# Altium schematic sheet PDB_Mother_v1.1_Sheet.SchDoc: PDB1.0_Mother
size A1; SheetNumber: 1; SheetTotal: 1
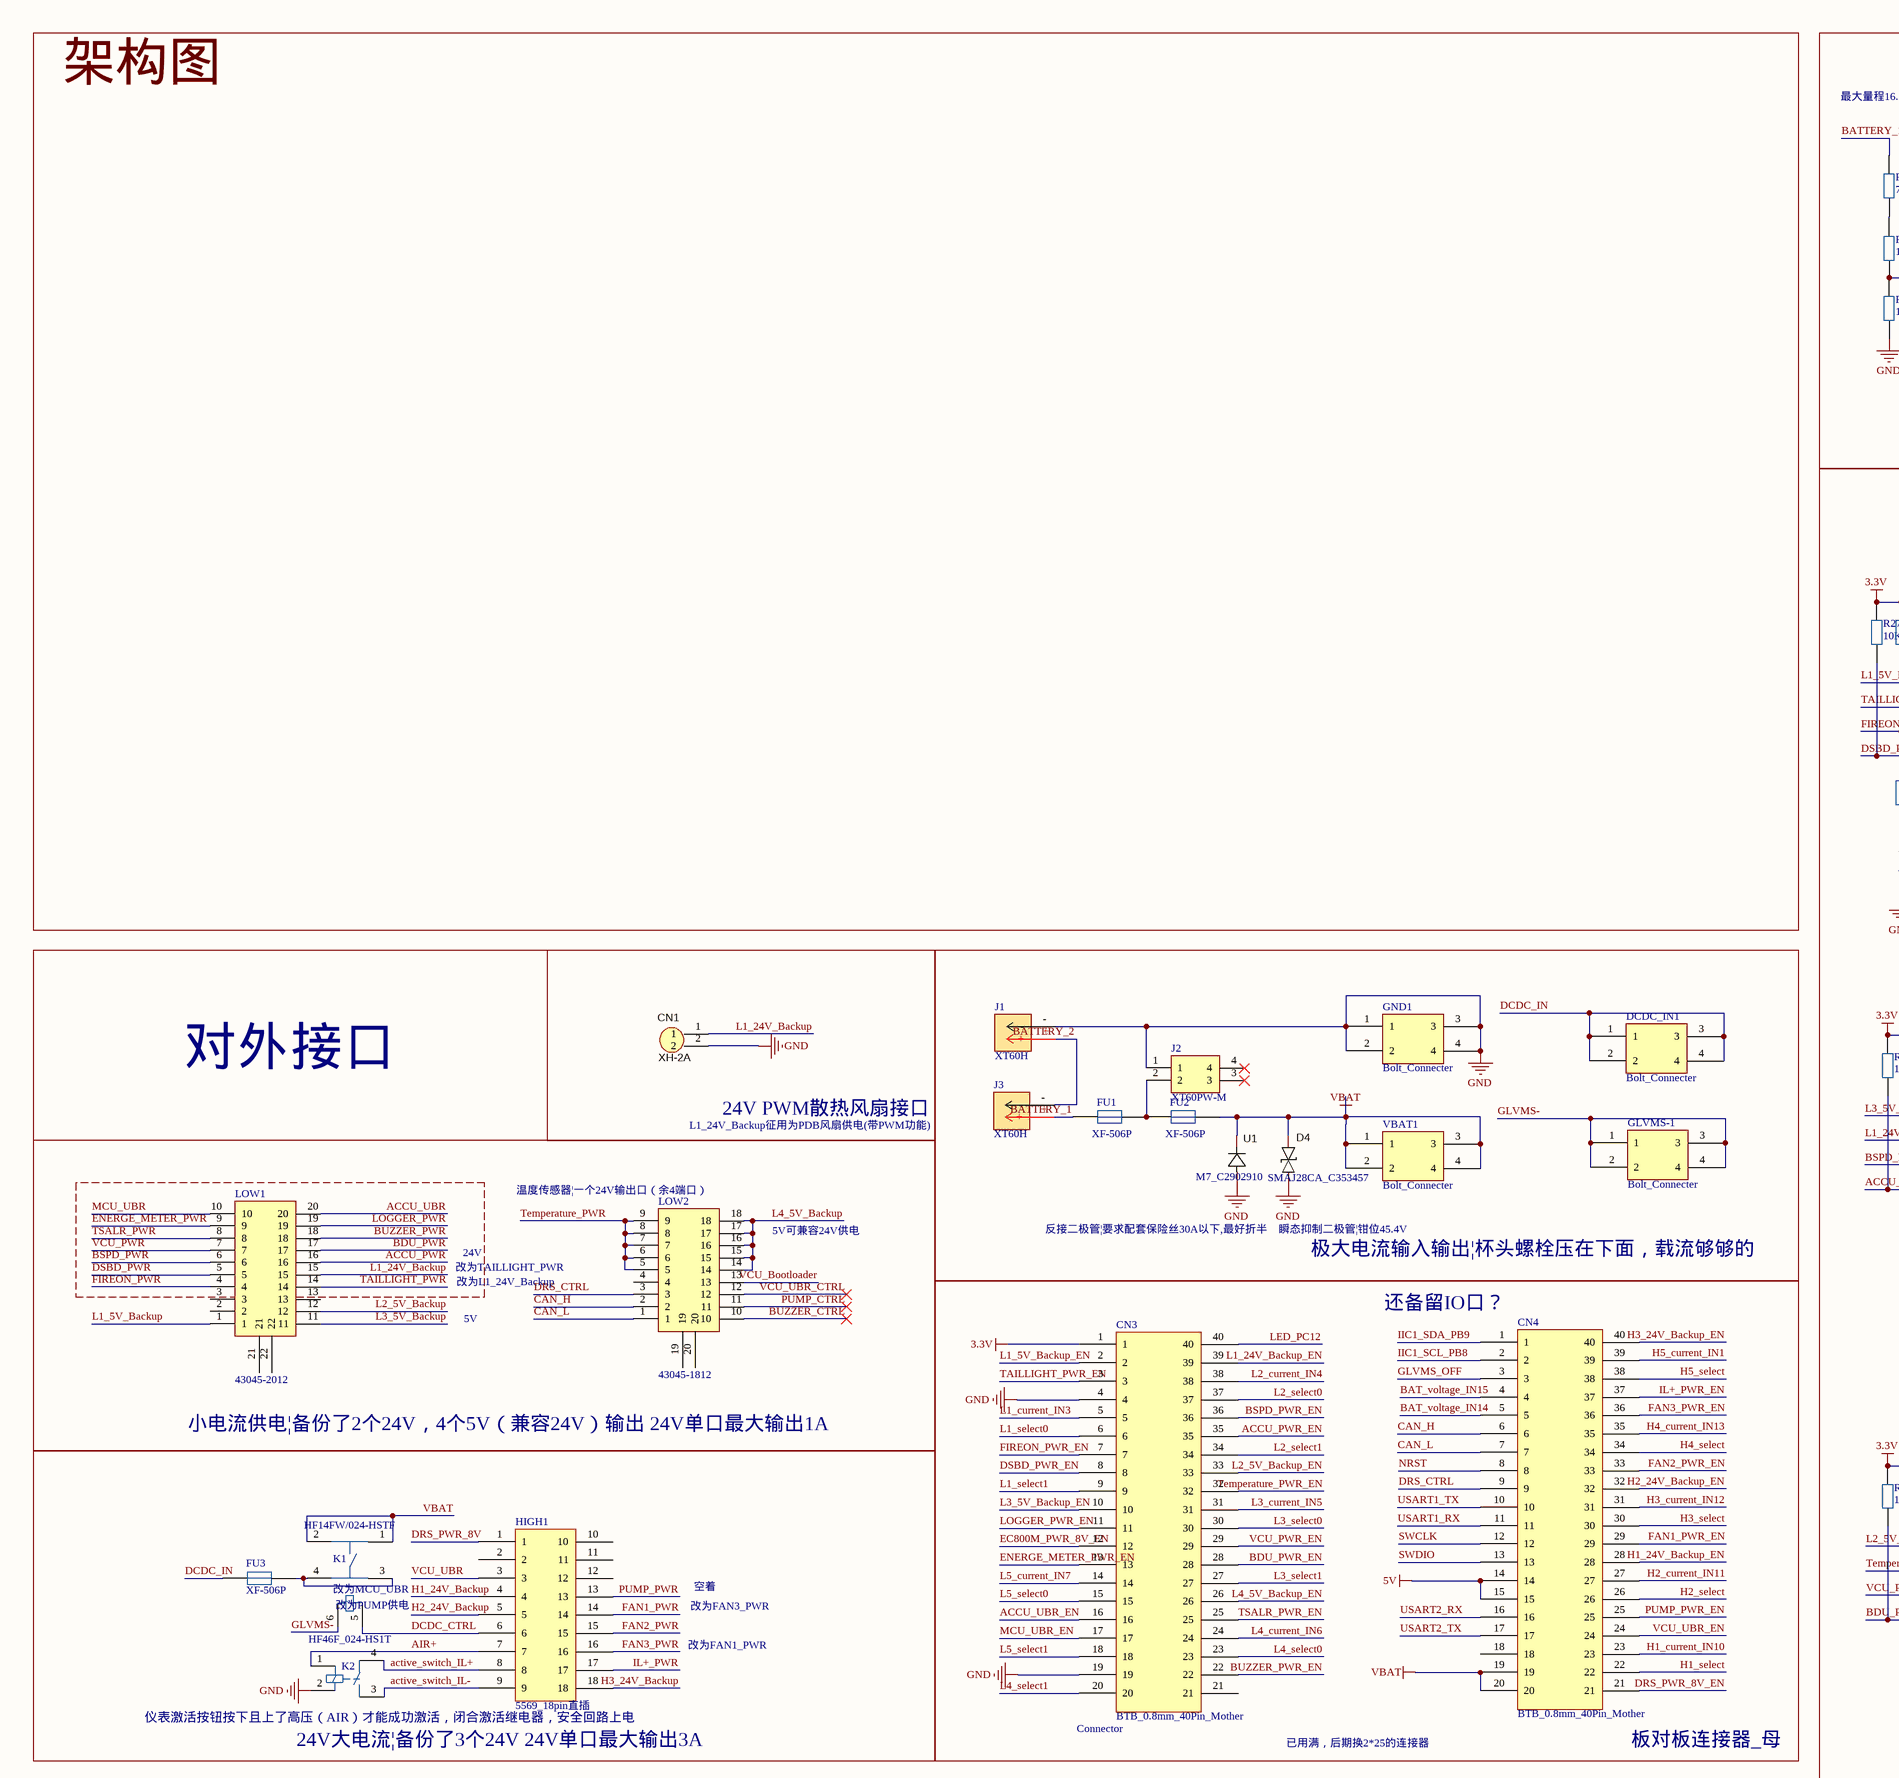
[diagram p0: PDB_Mother_v1.1_Sheet.SchDoc, top left]
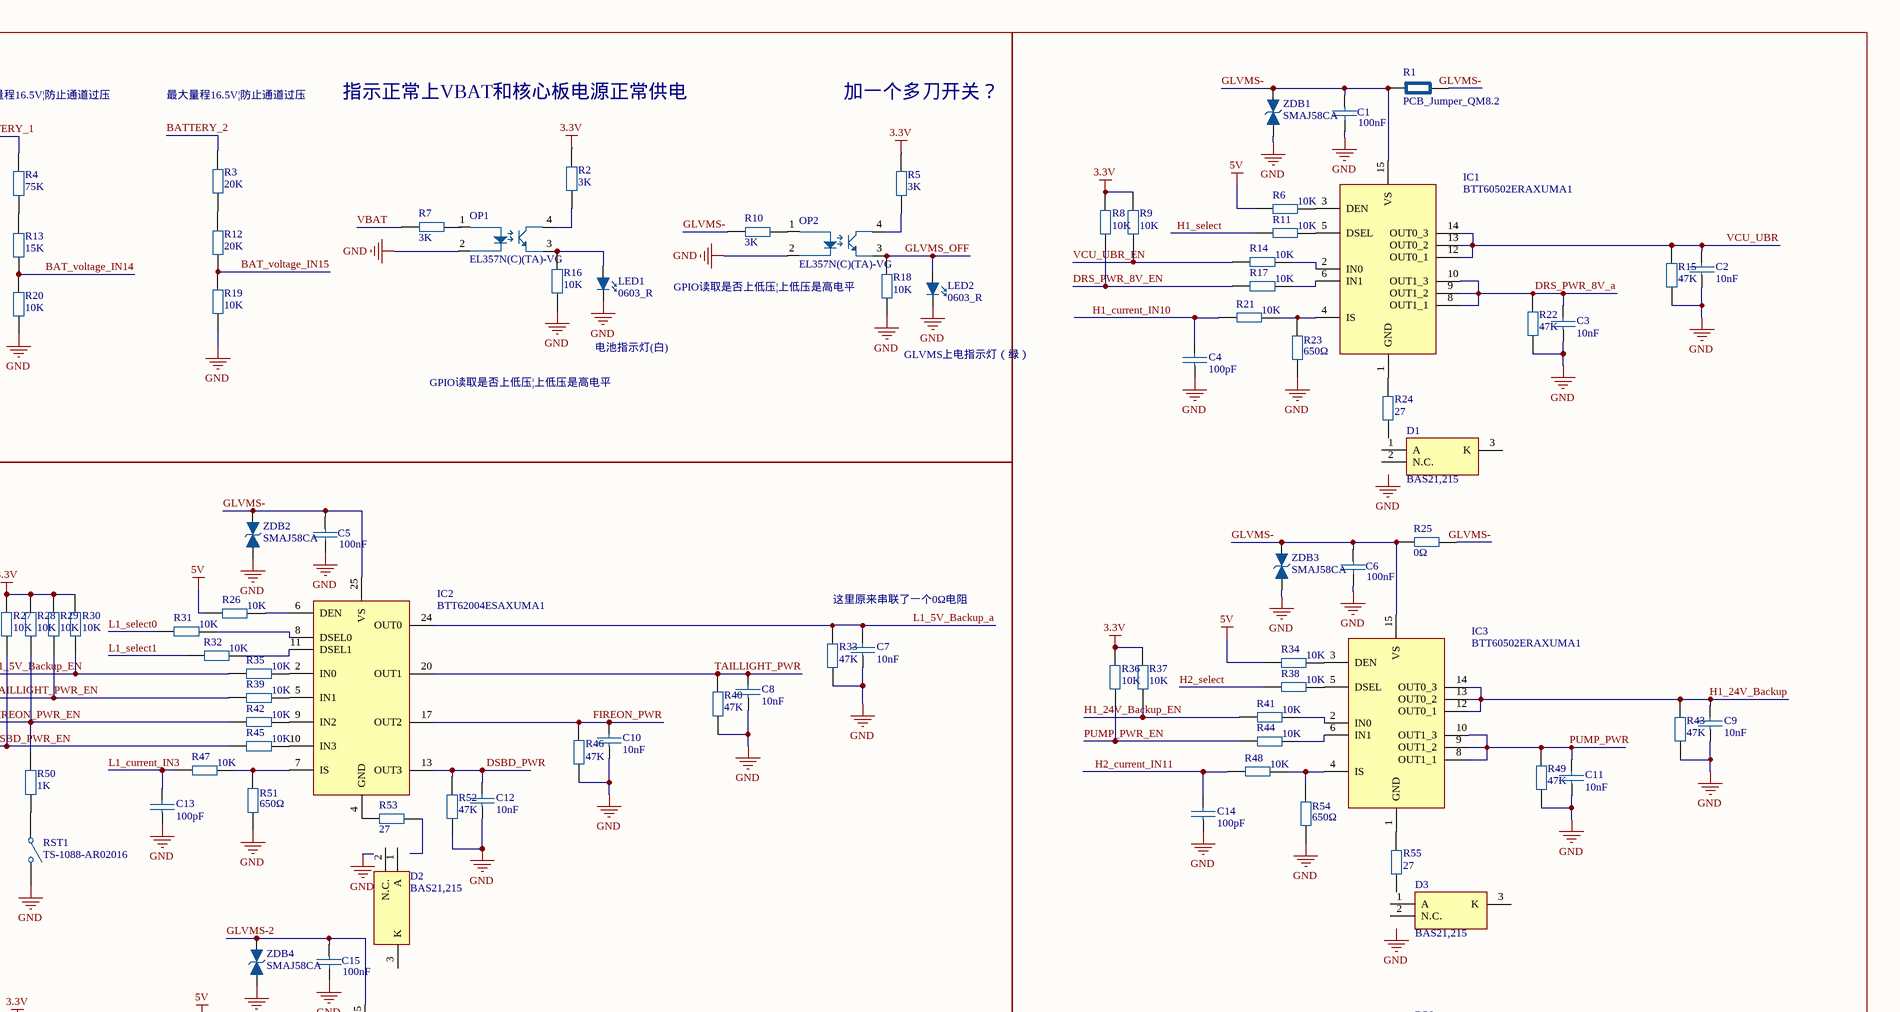
[diagram p1: PDB_Mother_v1.1_Sheet.SchDoc, top right]
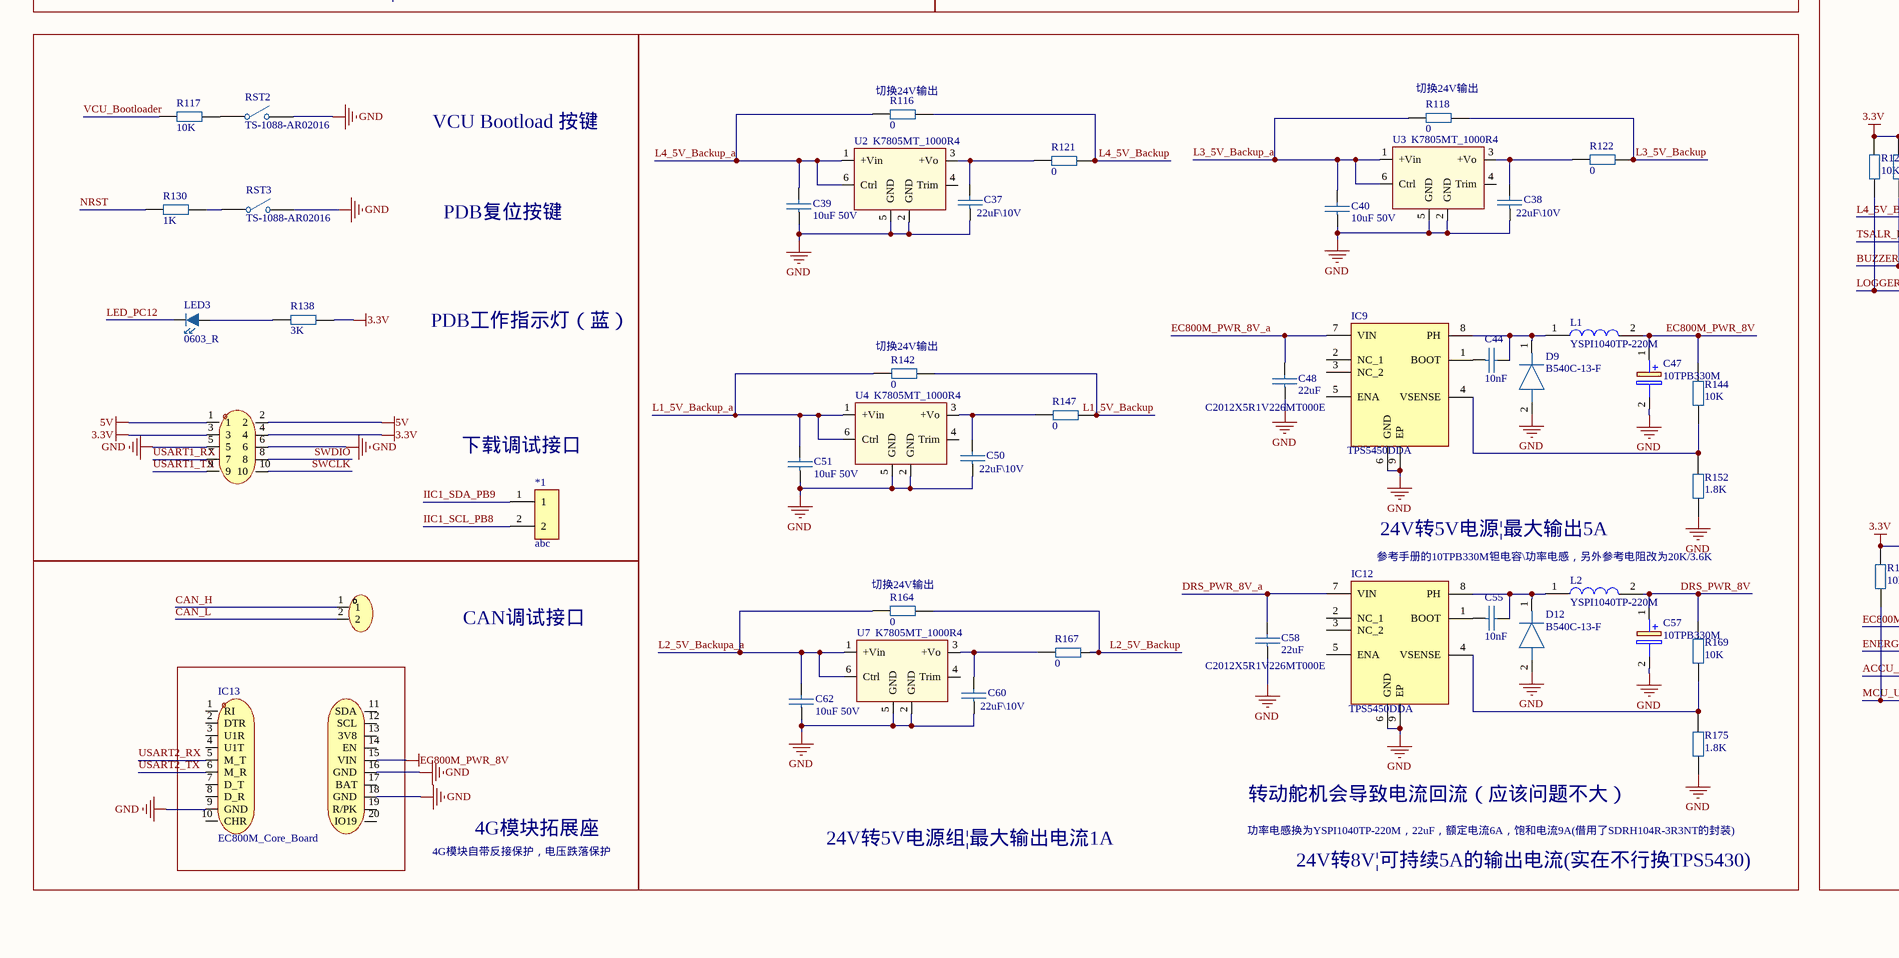
[diagram p2: PDB_Mother_v1.1_Sheet.SchDoc, bottom left]
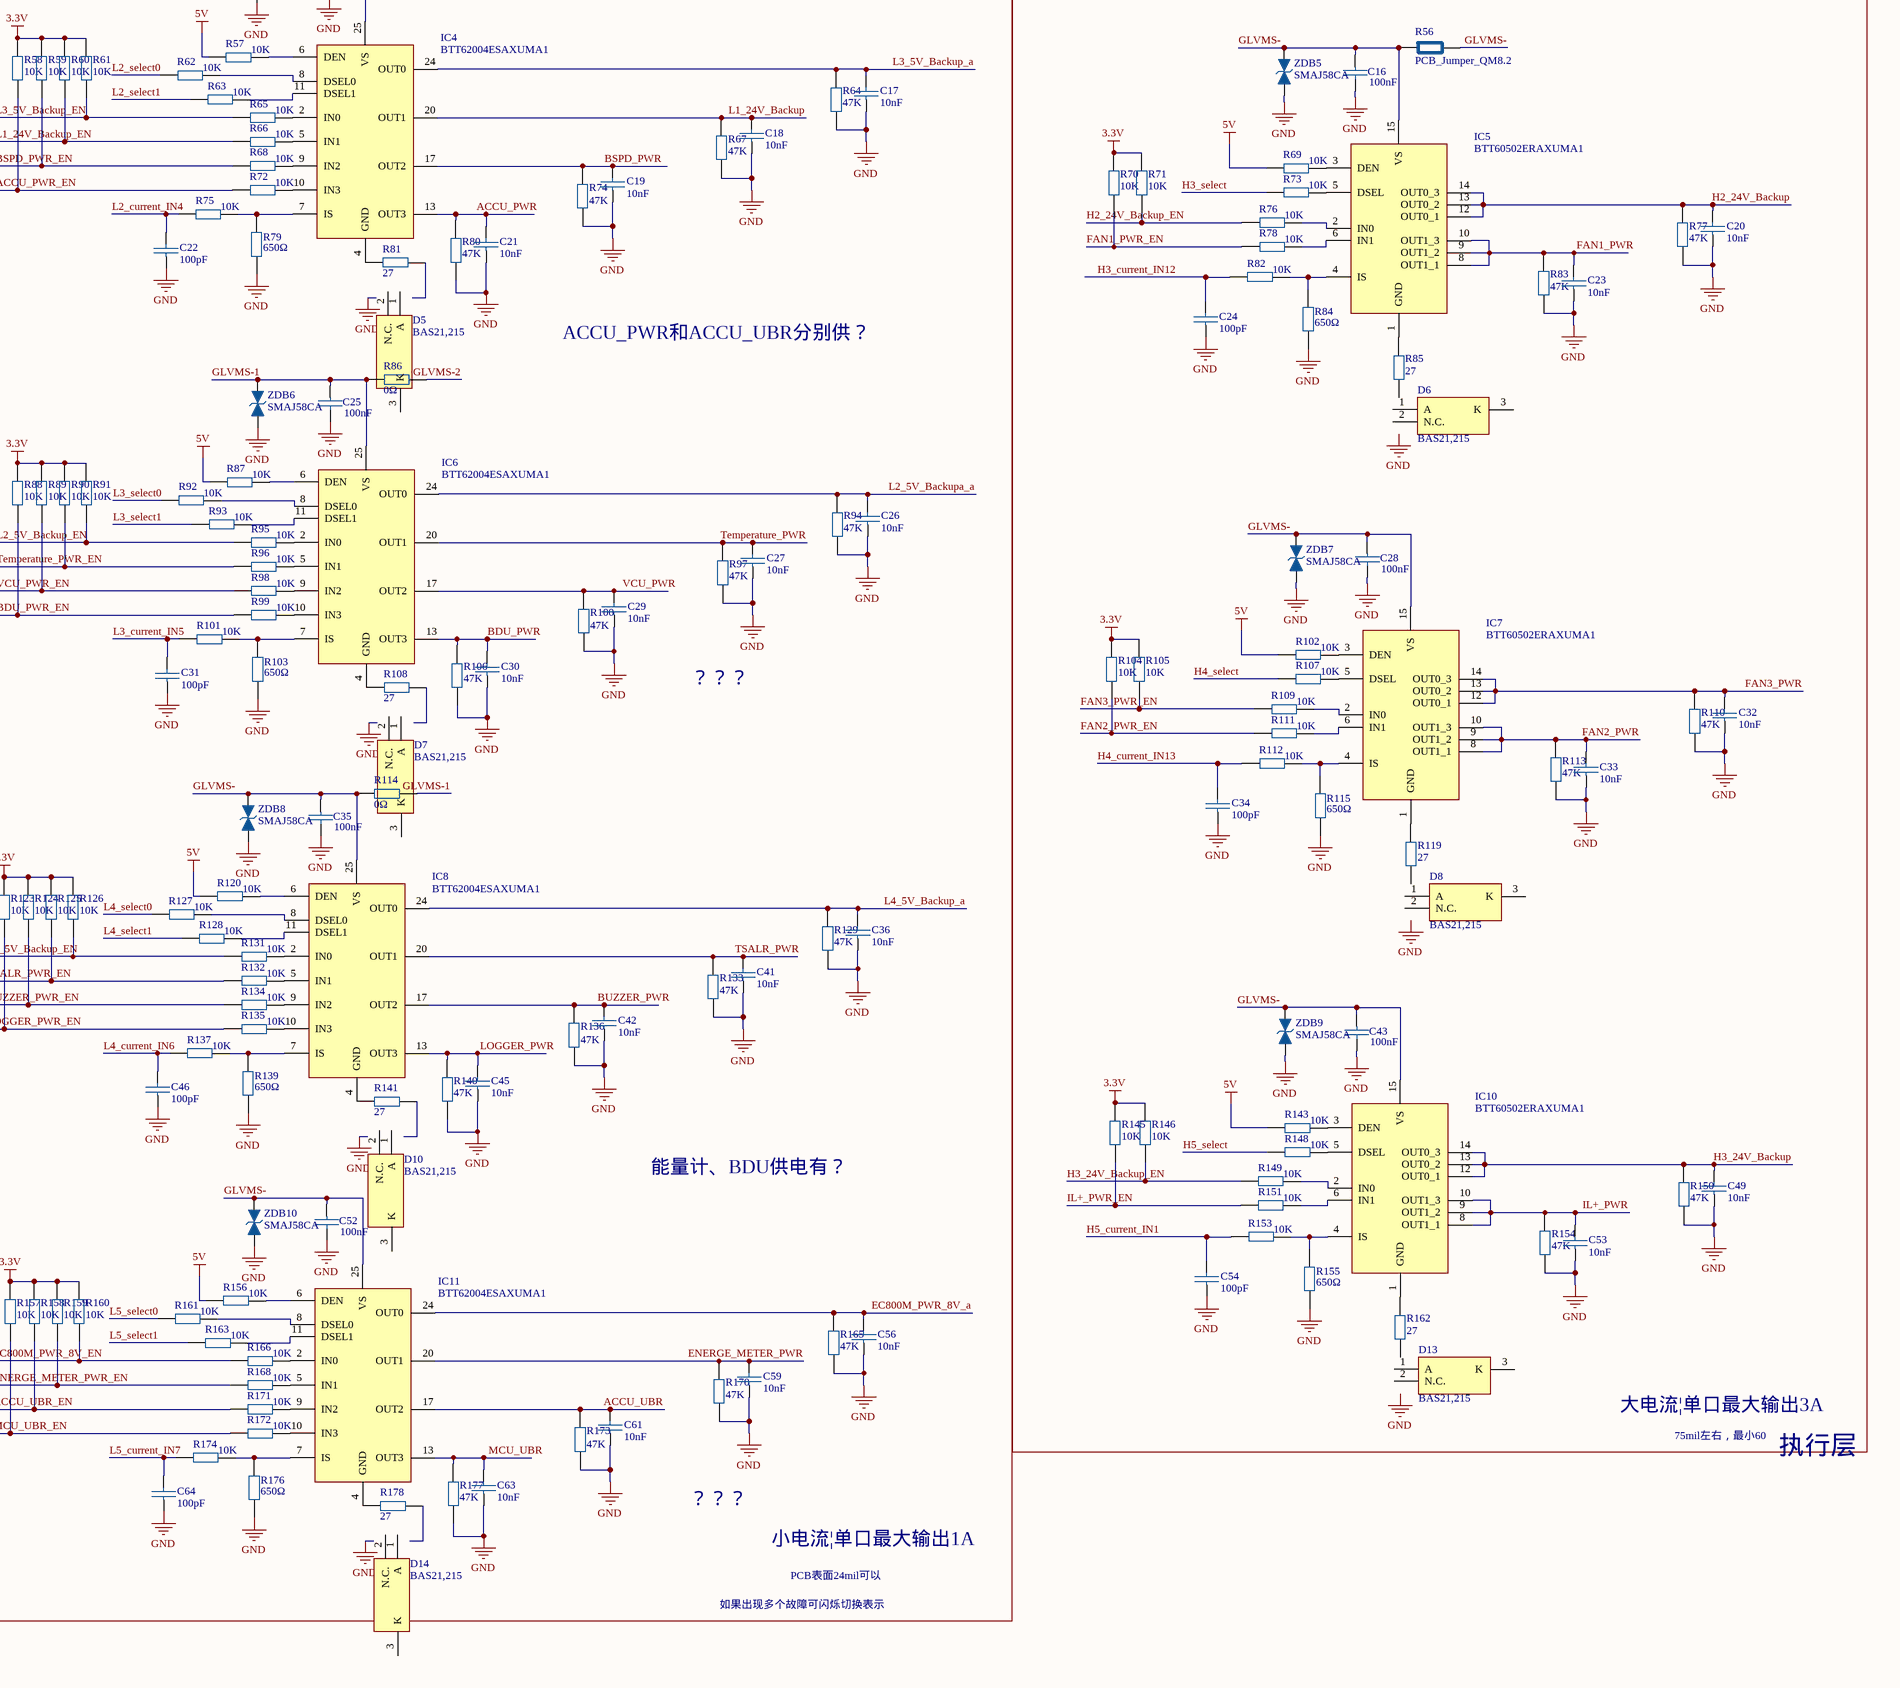
[diagram p3: PDB_Mother_v1.1_Sheet.SchDoc, bottom right]

## Parts
*1  abc  [abc]
C1  100nF  [CAPC1608X08N__0603CAPUNPOLE]
C2  10nF  [CAPC1608X08N__0603CAPUNPOLE]
C3  10nF  [CAPC1608X08N__0603CAPUNPOLE]
C4  100pF  [CAPC1608X08N__0603CAPUNPOLE]
C5  100nF  [CAPC1608X08N__0603CAPUNPOLE]
C6  100nF  [CAPC1608X08N__0603CAPUNPOLE]
C7  10nF  [CAPC1608X08N__0603CAPUNPOLE]
C8  10nF  [CAPC1608X08N__0603CAPUNPOLE]
C9  10nF  [CAPC1608X08N__0603CAPUNPOLE]
C10  10nF  [CAPC1608X08N__0603CAPUNPOLE]
C11  10nF  [CAPC1608X08N__0603CAPUNPOLE]
C12  10nF  [CAPC1608X08N__0603CAPUNPOLE]
C13  100pF  [CAPC1608X08N__0603CAPUNPOLE]
C14  100pF  [CAPC1608X08N__0603CAPUNPOLE]
C15  100nF  [CAPC1608X08N__0603CAPUNPOLE]
C16  100nF  [CAPC1608X08N__0603CAPUNPOLE]
C17  10nF  [CAPC1608X08N__0603CAPUNPOLE]
C18  10nF  [CAPC1608X08N__0603CAPUNPOLE]
C19  10nF  [CAPC1608X08N__0603CAPUNPOLE]
C20  10nF  [CAPC1608X08N__0603CAPUNPOLE]
C21  10nF  [CAPC1608X08N__0603CAPUNPOLE]
C22  100pF  [CAPC1608X08N__0603CAPUNPOLE]
C23  10nF  [CAPC1608X08N__0603CAPUNPOLE]
C24  100pF  [CAPC1608X08N__0603CAPUNPOLE]
C25  100nF  [CAPC1608X08N__0603CAPUNPOLE]
C26  10nF  [CAPC1608X08N__0603CAPUNPOLE]
C27  10nF  [CAPC1608X08N__0603CAPUNPOLE]
C28  100nF  [CAPC1608X08N__0603CAPUNPOLE]
C29  10nF  [CAPC1608X08N__0603CAPUNPOLE]
C30  10nF  [CAPC1608X08N__0603CAPUNPOLE]
C31  100pF  [CAPC1608X08N__0603CAPUNPOLE]
C32  10nF  [CAPC1608X08N__0603CAPUNPOLE]
C33  10nF  [CAPC1608X08N__0603CAPUNPOLE]
C34  100pF  [CAPC1608X08N__0603CAPUNPOLE]
C35  100nF  [CAPC1608X08N__0603CAPUNPOLE]
C36  10nF  [CAPC1608X08N__0603CAPUNPOLE]
C37  22uF\10V  [CAPC1608X08N__0603CAPUNPOLE]
C38  22uF\10V  [CAPC1608X08N__0603CAPUNPOLE]
C39  10uF 50V  [CAPC3216X16N_1206CAPUNPOLE]
C40  10uF 50V  [CAPC3216X16N_1206CAPUNPOLE]
C41  10nF  [CAPC1608X08N__0603CAPUNPOLE]
C42  10nF  [CAPC1608X08N__0603CAPUNPOLE]
C43  100nF  [CAPC1608X08N__0603CAPUNPOLE]
C44  10nF  [CAPC1608X08N__0603CAPUNPOLE]
C45  10nF  [CAPC1608X08N__0603CAPUNPOLE]
C46  100pF  [CAPC1608X08N__0603CAPUNPOLE]
C47  10TPB330M  [POSCAP_D12_D15_D15E_D2E_D2_D3L_D4]
C48  22uF  [CAPC2012X06N__0805CAPUNPOLE]
C49  10nF  [CAPC1608X08N__0603CAPUNPOLE]
C50  22uF\10V  [CAPC1608X08N__0603CAPUNPOLE]
C51  10uF 50V  [CAPC3216X16N_1206CAPUNPOLE]
C52  100nF  [CAPC1608X08N__0603CAPUNPOLE]
C53  10nF  [CAPC1608X08N__0603CAPUNPOLE]
C54  100pF  [CAPC1608X08N__0603CAPUNPOLE]
C55  10nF  [CAPC1608X08N__0603CAPUNPOLE]
C56  10nF  [CAPC1608X08N__0603CAPUNPOLE]
C57  10TPB330M  [POSCAP_D12_D15_D15E_D2E_D2_D3L_D4]
C58  22uF  [CAPC2012X06N__0805CAPUNPOLE]
C59  10nF  [CAPC1608X08N__0603CAPUNPOLE]
C60  22uF\10V  [CAPC1608X08N__0603CAPUNPOLE]
C61  10nF  [CAPC1608X08N__0603CAPUNPOLE]
C62  10uF 50V  [CAPC3216X16N_1206CAPUNPOLE]
C63  10nF  [CAPC1608X08N__0603CAPUNPOLE]
C64  100pF  [CAPC1608X08N__0603CAPUNPOLE]
CN1  XH-2A  [CONN-TH_XH-2A]
CN3  BTB_0.8mm_40Pin_Mother  System: Connector  [BTB_0.8mm_40PIN_M]
CN4  BTB_0.8mm_40Pin_Mother  [BTB_0.8mm_40PIN_M]
D1  BAS21,215  [BAS21215]
D2  BAS21,215  [BAS21215]
D3  BAS21,215  [BAS21215]
D4  SMAJ28CA_C353457  [SMA_L4.3-W2.5-LS5.0-BI]
D5  BAS21,215  [BAS21215]
D6  BAS21,215  [BAS21215]
D7  BAS21,215  [BAS21215]
D8  BAS21,215  [BAS21215]
D9  B540C-13-F  [DIOM7959X250N]
D10  BAS21,215  [BAS21215]
D12  B540C-13-F  [DIOM7959X250N]
D13  BAS21,215  [BAS21215]
D14  BAS21,215  [BAS21215]
DCDC_IN1  Bolt_Connecter  [Bolt_Connecter]
FU1  XF-506P  [XF-506P]
FU2  XF-506P  [XF-506P]
FU3  XF-506P  [XF-506P]
GLVMS-1  Bolt_Connecter  [Bolt_Connecter]
GND1  Bolt_Connecter  [Bolt_Connecter]
HIGH1  5569_18pin直插  [5569_18Pin]
IC1  BTT60502ERAXUMA1  [PG-TDSO-14]
IC2  BTT62004ESAXUMA1  [PG-TSDSO-24]
IC3  BTT60502ERAXUMA1  [PG-TDSO-14]
IC4  BTT62004ESAXUMA1  [PG-TSDSO-24]
IC5  BTT60502ERAXUMA1  [PG-TDSO-14]
IC6  BTT62004ESAXUMA1  [PG-TSDSO-24]
IC7  BTT60502ERAXUMA1  [PG-TDSO-14]
IC8  BTT62004ESAXUMA1  [PG-TSDSO-24]
IC9  TPS5450DDA  [SOIC127P600X170-9N]
IC10  BTT60502ERAXUMA1  [PG-TDSO-14]
IC11  BTT62004ESAXUMA1  [PG-TSDSO-24]
IC12  TPS5450DDA  [SOIC127P600X170-9N]
IC13  EC800M_Core_Board  [EC800M_Core_Board]
J1  XT60H  [AMASS_XT60_NOMAL]
J2  XT60PW-M  [XT60PWM]
J3  XT60H  [AMASS_XT60_NOMAL]
K1  HF14FW/024-HSTF  [HF14FW005HPTF]
K2  HF46F_024-HS1T  [HF46F024HS1T]
L1  YSPI1040TP-220M  [SDRH104R3R3NT]
L2  YSPI1040TP-220M  [SDRH104R3R3NT]
LED1  0603_R  [LED0603-RD_RED]
LED2  0603_R  [LED0603-RD_RED]
LED3  0603_R  [LED0603-RD_RED]
LOW1  43045-2012  [43045-20YY_121314]
LOW2  43045-1812  [43045-18YY_121314]
OP1  EL357N(C)(TA)-VG  [SOP-4-2.54mm]
OP2  EL357N(C)(TA)-VG  [SOP-4-2.54mm]
R1  PCB_Jumper_QM8.2  [PCB_Jumper]
R2  3K  [RESC3116X06N__1206RES]
R3  20K  [RESC1608X04N_0603RES]
R4  75K  [RESC1608X04N_0603RES]
R5  3K  [RESC3116X06N__1206RES]
R6  10K  [RESC1608X04N_0603RES]
R7  3K  [RESC3116X06N__1206RES]
R8  10K  [RESC1608X04N_0603RES]
R9  10K  [RESC1608X04N_0603RES]
R10  3K  [RESC3116X06N__1206RES]
R11  10K  [RESC1608X04N_0603RES]
R12  20K  [RESC1608X04N_0603RES]
R13  15K  [RESC1608X04N_0603RES]
R14  10K  [RESC1608X04N_0603RES]
R15  47K  [RESC1608X04N_0603RES]
R16  10K  [RESC1608X04N_0603RES]
R17  10K  [RESC1608X04N_0603RES]
R18  10K  [RESC1608X04N_0603RES]
R19  10K  [RESC1608X04N_0603RES]
R20  10K  [RESC1608X04N_0603RES]
R21  10K  [RESC1608X04N_0603RES]
R22  47K  [RESC1608X04N_0603RES]
R23  650Ω  [RESC1608X04N_0603RES]
R24  27  [RESC1608X04N_0603RES]
R25  0Ω  [RESC6432X06N__2512RES]
R26  10K  [RESC1608X04N_0603RES]
R27  10K  [RESC1608X04N_0603RES]
R28  10K  [RESC1608X04N_0603RES]
R29  10K  [RESC1608X04N_0603RES]
R30  10K  [RESC1608X04N_0603RES]
R31  10K  [RESC1608X04N_0603RES]
R32  10K  [RESC1608X04N_0603RES]
R33  47K  [RESC1608X04N_0603RES]
R34  10K  [RESC1608X04N_0603RES]
R35  10K  [RESC1608X04N_0603RES]
R36  10K  [RESC1608X04N_0603RES]
R37  10K  [RESC1608X04N_0603RES]
R38  10K  [RESC1608X04N_0603RES]
R39  10K  [RESC1608X04N_0603RES]
R40  47K  [RESC1608X04N_0603RES]
R41  10K  [RESC1608X04N_0603RES]
R42  10K  [RESC1608X04N_0603RES]
R43  47K  [RESC1608X04N_0603RES]
R44  10K  [RESC1608X04N_0603RES]
R45  10K  [RESC1608X04N_0603RES]
R46  47K  [RESC1608X04N_0603RES]
R47  10K  [RESC1608X04N_0603RES]
R48  10K  [RESC1608X04N_0603RES]
R49  47K  [RESC1608X04N_0603RES]
R50  1K  [RESC1608X04N_0603RES]
R51  650Ω  [RESC1608X04N_0603RES]
R52  47K  [RESC1608X04N_0603RES]
R53  27  [RESC1608X04N_0603RES]
R54  650Ω  [RESC1608X04N_0603RES]
R55  27  [RESC1608X04N_0603RES]
R56  PCB_Jumper_QM8.2  [PCB_Jumper]
R57  10K  [RESC1608X04N_0603RES]
R58  10K  [RESC1608X04N_0603RES]
R59  10K  [RESC1608X04N_0603RES]
R60  10K  [RESC1608X04N_0603RES]
R61  10K  [RESC1608X04N_0603RES]
R62  10K  [RESC1608X04N_0603RES]
R63  10K  [RESC1608X04N_0603RES]
R64  47K  [RESC1608X04N_0603RES]
R65  10K  [RESC1608X04N_0603RES]
R66  10K  [RESC1608X04N_0603RES]
R67  47K  [RESC1608X04N_0603RES]
R68  10K  [RESC1608X04N_0603RES]
R69  10K  [RESC1608X04N_0603RES]
R70  10K  [RESC1608X04N_0603RES]
R71  10K  [RESC1608X04N_0603RES]
R72  10K  [RESC1608X04N_0603RES]
R73  10K  [RESC1608X04N_0603RES]
R74  47K  [RESC1608X04N_0603RES]
R75  10K  [RESC1608X04N_0603RES]
R76  10K  [RESC1608X04N_0603RES]
R77  47K  [RESC1608X04N_0603RES]
R78  10K  [RESC1608X04N_0603RES]
R79  650Ω  [RESC1608X04N_0603RES]
R80  47K  [RESC1608X04N_0603RES]
R81  27  [RESC1608X04N_0603RES]
R82  10K  [RESC1608X04N_0603RES]
R83  47K  [RESC1608X04N_0603RES]
R84  650Ω  [RESC1608X04N_0603RES]
R85  27  [RESC1608X04N_0603RES]
R86  0Ω  [RESC6432X06N__2512RES]
R87  10K  [RESC1608X04N_0603RES]
R88  10K  [RESC1608X04N_0603RES]
R89  10K  [RESC1608X04N_0603RES]
R90  10K  [RESC1608X04N_0603RES]
R91  10K  [RESC1608X04N_0603RES]
R92  10K  [RESC1608X04N_0603RES]
R93  10K  [RESC1608X04N_0603RES]
R94  47K  [RESC1608X04N_0603RES]
R95  10K  [RESC1608X04N_0603RES]
R96  10K  [RESC1608X04N_0603RES]
R97  47K  [RESC1608X04N_0603RES]
R98  10K  [RESC1608X04N_0603RES]
R99  10K  [RESC1608X04N_0603RES]
R100  47K  [RESC1608X04N_0603RES]
R101  10K  [RESC1608X04N_0603RES]
R102  10K  [RESC1608X04N_0603RES]
R103  650Ω  [RESC1608X04N_0603RES]
R104  10K  [RESC1608X04N_0603RES]
R105  10K  [RESC1608X04N_0603RES]
R106  47K  [RESC1608X04N_0603RES]
R107  10K  [RESC1608X04N_0603RES]
R108  27  [RESC1608X04N_0603RES]
R109  10K  [RESC1608X04N_0603RES]
R110  47K  [RESC1608X04N_0603RES]
R111  10K  [RESC1608X04N_0603RES]
R112  10K  [RESC1608X04N_0603RES]
R113  47K  [RESC1608X04N_0603RES]
R114  0Ω  [RESC6432X06N__2512RES]
R115  650Ω  [RESC1608X04N_0603RES]
R116  0  [RESC6432X06N__2512RES]
R117  10K  [RESC1608X04N_0603RES]
R118  0  [RESC6432X06N__2512RES]
R119  27  [RESC1608X04N_0603RES]
R120  10K  [RESC1608X04N_0603RES]
R121  0  [RESC6432X06N__2512RES]
R122  0  [RESC6432X06N__2512RES]
R123  10K  [RESC1608X04N_0603RES]
R124  10K  [RESC1608X04N_0603RES]
R125  10K  [RESC1608X04N_0603RES]
R126  10K  [RESC1608X04N_0603RES]
R127  10K  [RESC1608X04N_0603RES]
R128  10K  [RESC1608X04N_0603RES]
R129  47K  [RESC1608X04N_0603RES]
R130  1K  [RESC1608X04N_0603RES]
R131  10K  [RESC1608X04N_0603RES]
R132  10K  [RESC1608X04N_0603RES]
R133  47K  [RESC1608X04N_0603RES]
R134  10K  [RESC1608X04N_0603RES]
R135  10K  [RESC1608X04N_0603RES]
R136  47K  [RESC1608X04N_0603RES]
R137  10K  [RESC1608X04N_0603RES]
R138  3K  [RESC1608X04N_0603RES]
R139  650Ω  [RESC1608X04N_0603RES]
R140  47K  [RESC1608X04N_0603RES]
R141  27  [RESC1608X04N_0603RES]
R142  0  [RESC6432X06N__2512RES]
R143  10K  [RESC1608X04N_0603RES]
R144  10K  [RESC1608X04N_0603RES]
R145  10K  [RESC1608X04N_0603RES]
R146  10K  [RESC1608X04N_0603RES]
R147  0  [RESC6432X06N__2512RES]
R148  10K  [RESC1608X04N_0603RES]
R149  10K  [RESC1608X04N_0603RES]
R150  47K  [RESC1608X04N_0603RES]
R151  10K  [RESC1608X04N_0603RES]
R152  1.8K  [RESC1608X04N_0603RES]
R153  10K  [RESC1608X04N_0603RES]
R154  47K  [RESC1608X04N_0603RES]
R155  650Ω  [RESC1608X04N_0603RES]
R156  10K  [RESC1608X04N_0603RES]
R157  10K  [RESC1608X04N_0603RES]
R158  10K  [RESC1608X04N_0603RES]
R159  10K  [RESC1608X04N_0603RES]
R160  10K  [RESC1608X04N_0603RES]
R161  10K  [RESC1608X04N_0603RES]
R162  27  [RESC1608X04N_0603RES]
R163  10K  [RESC1608X04N_0603RES]
R164  0  [RESC6432X06N__2512RES]
R165  47K  [RESC1608X04N_0603RES]
R166  10K  [RESC1608X04N_0603RES]
R167  0  [RESC6432X06N__2512RES]
R168  10K  [RESC1608X04N_0603RES]
R169  10K  [RESC1608X04N_0603RES]
R170  47K  [RESC1608X04N_0603RES]
R171  10K  [RESC1608X04N_0603RES]
R172  10K  [RESC1608X04N_0603RES]
R173  47K  [RESC1608X04N_0603RES]
R174  10K  [RESC1608X04N_0603RES]
R175  1.8K  [RESC1608X04N_0603RES]
R176  650Ω  [RESC1608X04N_0603RES]
R177  47K  [RESC1608X04N_0603RES]
R178  27  [RESC1608X04N_0603RES]
RST1  TS-1088-AR02016  [SW-SMD_L3.9-W3.0-P4.45]
RST2  TS-1088-AR02016  [SW-SMD_L3.9-W3.0-P4.45]
RST3  TS-1088-AR02016  [SW-SMD_L3.9-W3.0-P4.45]
U1  M7_C2902910  [SMA_L4.5-W2.7-LS5.1-RD]
U2  K7805MT_1000R4  [K7805MT_500R4]
U3  K7805MT_1000R4  [K7805MT_500R4]
U4  K7805MT_1000R4  [K7805MT_500R4]
U5  ZX-PZ2.54-2-5PZZ  [HDR-TH_10P-P2.54-V-M-R2-C5-S2.54]  (value not drawn)
U6  KF301-5.0-2P  [CONN-TH_P5.00_KF301-5.0-2P]  (value not drawn)
U7  K7805MT_1000R4  [K7805MT_500R4]
VBAT1  Bolt_Connecter  [Bolt_Connecter]
ZDB1  SMAJ58CA  [SMA/DO214AC-BIPOLAR]
ZDB2  SMAJ58CA  [SMA/DO214AC-BIPOLAR]
ZDB3  SMAJ58CA  [SMA/DO214AC-BIPOLAR]
ZDB4  SMAJ58CA  [SMA/DO214AC-BIPOLAR]
ZDB5  SMAJ58CA  [SMA/DO214AC-BIPOLAR]
ZDB6  SMAJ58CA  [SMA/DO214AC-BIPOLAR]
ZDB7  SMAJ58CA  [SMA/DO214AC-BIPOLAR]
ZDB8  SMAJ58CA  [SMA/DO214AC-BIPOLAR]
ZDB9  SMAJ58CA  [SMA/DO214AC-BIPOLAR]
ZDB10  SMAJ58CA  [SMA/DO214AC-BIPOLAR]

## Blocks framed on the sheet
大电流¦单口最大输出3A: C1-C4 C6 C9 C11 C14 C16 C20 C23 C24 C28 C32-C34 C43 C49 C53 C54 D1 D3 D6 D8 D13 IC1 IC3 IC5 IC7 IC10 R1 R6 R8 R9 R11 R14 R15 R17 R21-R25 R34 R36-R38 R41 R43 R44 R48 R49 R54-R56 R69-R71 R73 R76-R78 R82-R85 R102 R104 R105 R107 R109-R113 R115 R119 R143 R145 R146 R148-R151 R153-R155 R162 ZDB1 ZDB3 ZDB5 ZDB7 ZDB9
对外接口: CN3 CN4 FU3 HIGH1 K1 K2
24V PWM散热风扇接口: CN1
极大电流输入输出¦杯头螺栓压在下面，载流够够的: D4 DCDC_IN1 FU1 FU2 GLVMS-1 GND1 J1-J3 U1 VBAT1
小电流供电¦备份了2个24V，4个5V（兼容24V）输出 24V单口最大输出1A: LOW1 LOW2

## Nets
3.3V: CN3.1 R2.1 R5.1 R8.1 R9.1 R27.1 R28.1 R29.1 R30.1 R36.1 R37.1 R58.1 R59.1 R60.1 R61.1 R70.1 R71.1 R88.1 R89.1 R90.1 R91.1 R104.1 R105.1 R123.1 R124.1 R125.1 R126.1 R138.2 R145.1 R146.1 R157.1 R158.1 R159.1 R160.1 U5.3 U5.4
5V: CN4.14 CN4.15 R6.2 R26.2 R34.2 R57.2 R69.2 R87.2 R102.2 R120.2 R143.2 R156.2 U5.1 U5.2
EC800M_PWR_8V: C47.1(+) IC13.15(VIN) L1.2 R144.2
GND: C1.2 C2.1 C3.1 C4.1 C5.2 C6.2 C7.1 C8.1 C9.1 C10.1 C11.1 C12.1 C13.1 C14.1 C15.2 C16.2 C17.1 C18.1 C19.1 C20.1 C21.1 C22.1 C23.1 C24.1 C25.2 C26.1 C27.1 C28.2 C29.1 C30.1 C31.1 C32.1 C33.1 C34.1 C35.2 C36.1 C37.1 C38.1 C39.1 C40.1 C41.1 C42.1 C43.2 C45.1 C46.1 C47.2(-) C48.1 C49.1 C50.1 C51.1 C52.2 C53.1 C54.1 C56.1 C57.2(-) C58.1 C59.1 C60.1 C61.1 C62.1 C63.1 C64.1 CN1.2 CN3.4 CN3.19 D4.2 D9.2(A) D12.2(A) GND1.1 GND1.2 GND1.3 GND1.4 IC9.6(GND) IC9.9(EP) IC12.6(GND) IC12.9(EP) IC13.9(GND) IC13.16(GND) IC13.18(GND) J1.- J2.1 K2.2(COIL_2) LED1.1 LED2.1 OP1.2 OP2.2 R15.1 R16.1 R18.1 R19.2 R20.2 R22.1 R23.1 R33.1 R40.1 R43.1 R46.1 R49.1 R51.1 R52.1 R54.1 R64.1 R67.1 R74.1 R77.1 R79.1 R80.1 R83.1 R84.1 R94.1 R97.1 R100.1 R103.1 R106.1 R110.1 R113.1 R115.1 R129.1 R133.1 R136.1 R139.1 R140.1 R150.1 R152.1 R154.1 R155.1 R165.1 R170.1 R173.1 R175.1 R176.1 R177.1 RST1.2(NO) RST2.2(NO) RST3.2(NO) U1.2(Anode) U2.2(GND) U2.5(GND) U3.2(GND) U3.5(GND) U4.2(GND) U4.5(GND) U5.5 U5.6 U7.2(GND) U7.5(GND) ZDB1.1 ZDB2.1 ZDB3.1 ZDB4.1 ZDB5.1 ZDB6.1 ZDB7.1 ZDB8.1 ZDB9.1 ZDB10.1
VBAT: CN4.19 CN4.20 D4.1 FU2.2 K1.1(NO_1) K1.2(NO_2) R7.2 U1.1(Cathode) VBAT1.1 VBAT1.2 VBAT1.3 VBAT1.4
ACCU_PWR: C21.2 IC4.13(OUT3) LOW1.16 R80.2
ACCU_PWR_EN: CN3.35 R58.2 R72.2
ACCU_UBR: C61.2 IC11.17(OUT2) LOW1.20 R173.2
ACCU_UBR_EN: CN3.16 R158.2 R171.2
active_switch_IL+: HIGH1.8 K2.4(COM)
active_switch_IL-: HIGH1.9 K2.3(NO)
AIR+: HIGH1.7 K2.1(COIL_1)
BAT_voltage_IN14: CN4.5 R13.2 R20.1
BAT_voltage_IN15: CN4.4 R12.2 R19.1
BATTERY_1: FU1.1 J3.+ R4.2
BATTERY_2: J1.+ J3.- R3.2
BDU_PWR: C30.2 IC6.13(OUT3) LOW1.17 R106.2
BDU_PWR_EN: CN3.28 R88.2 R99.2
BSPD_PWR: C19.2 IC4.17(OUT2) LOW1.6 R74.2
BSPD_PWR_EN: CN3.36 R59.2 R68.2
BUZZER_CTRL: LOW2.10
BUZZER_PWR: C42.2 IC8.17(OUT2) LOW1.18 R136.2
BUZZER_PWR_EN: CN3.22 R124.2 R134.2
CAN_H: CN4.6 LOW2.2 U6.1
CAN_L: CN4.7 LOW2.1 U6.2
DCDC_CTRL: HIGH1.6 K1.5(COIL_1)
DCDC_IN: DCDC_IN1.1 DCDC_IN1.2 DCDC_IN1.3 DCDC_IN1.4 FU3.2
DRS_CTRL: CN4.9 LOW2.3
DRS_PWR_8V: C57.1(+) HIGH1.1 L2.2 R169.2
DRS_PWR_8V_a: C3.2 C58.2 IC1.8(OUT1_1) IC1.9(OUT1_2) IC1.10(OUT1_3) IC12.7(VIN) R22.2
DRS_PWR_8V_EN: CN4.21 R8.2 R17.2
DSBD_PWR: C12.2 IC2.13(OUT3) LOW1.5 R52.2
DSBD_PWR_EN: CN3.8 R27.2 R45.2
EC800M_PWR_8V_a: C48.2 C56.2 IC9.7(VIN) IC11.24(OUT0) R165.2
EC800M_PWR_8V_EN: CN3.12 R160.2 R166.2
ENERGE_METER_PWR: C59.2 IC11.20(OUT1) LOW1.9 R170.2
ENERGE_METER_PWR_EN: CN3.13 R159.2 R168.2
FAN1_PWR: C23.2 HIGH1.14 IC5.8(OUT1_1) IC5.9(OUT1_2) IC5.10(OUT1_3) R83.2
FAN1_PWR_EN: CN4.29 R70.2 R78.2
FAN2_PWR: C33.2 HIGH1.15 IC7.8(OUT1_1) IC7.9(OUT1_2) IC7.10(OUT1_3) R113.2
FAN2_PWR_EN: CN4.33 R104.2 R111.2
FAN3_PWR: C32.2 HIGH1.16 IC7.12(OUT0_1) IC7.13(OUT0_2) IC7.14(OUT0_3) R110.2
FAN3_PWR_EN: CN4.36 R105.2 R109.2
FIREON_PWR: C10.2 IC2.17(OUT2) LOW1.4 R46.2
FIREON_PWR_EN: CN3.7 R28.2 R42.2 R50.1
GLVMS-: C1.1 C5.1 C6.1 C16.1 C28.1 C35.1 C43.1 C52.1 GLVMS-1.1 GLVMS-1.2 GLVMS-1.3 GLVMS-1.4 IC1.15(VS) IC2.25(VS) IC3.15(VS) IC5.15(VS) IC7.15(VS) IC8.25(VS) IC10.15(VS) IC11.25(VS) K1.6(COIL_2) R1.1 R1.2 R10.2 R25.1 R25.2 R56.1 R56.2 R114.1 ZDB1.2 ZDB2.2 ZDB3.2 ZDB5.2 ZDB7.2 ZDB8.2 ZDB9.2 ZDB10.2
GLVMS-1: C25.1 IC6.25(VS) R86.1 R114.2 ZDB6.2
GLVMS-2: C15.1 IC4.25(VS) R86.2 ZDB4.2
GLVMS_OFF: CN4.3 LED2.2 OP2.3 R18.2
H1_24V_Backup: C9.2 HIGH1.4 IC3.12(OUT0_1) IC3.13(OUT0_2) IC3.14(OUT0_3) R43.2
H1_24V_Backup_EN: CN4.28 R37.2 R41.2
H1_current_IN10: C4.2 CN4.23 R21.2
H1_select: CN4.22 R11.2
H2_24V_Backup: C20.2 HIGH1.5 IC5.12(OUT0_1) IC5.13(OUT0_2) IC5.14(OUT0_3) R77.2
H2_24V_Backup_EN: CN4.32 R71.2 R76.2
H2_current_IN11: C14.2 CN4.27 R48.2
H2_select: CN4.26 R38.2
H3_24V_Backup: C49.2 HIGH1.18 IC10.12(OUT0_1) IC10.13(OUT0_2) IC10.14(OUT0_3) R150.2
H3_24V_Backup_EN: CN4.40 R146.2 R149.2
H3_current_IN12: C24.2 CN4.31 R82.2
H3_select: CN4.30 R73.2
H4_current_IN13: C34.2 CN4.35 R112.2
H4_select: CN4.34 R107.2
H5_current_IN1: C54.2 CN4.39 R153.2
H5_select: CN4.38 R148.2
IIC1_SCL_PB8: *1.2 CN4.2
IIC1_SDA_PB9: *1.1 CN4.1
IL+_PWR: C53.2 HIGH1.17 IC10.8(OUT1_1) IC10.9(OUT1_2) IC10.10(OUT1_3) R154.2
IL+_PWR_EN: CN4.37 R145.2 R151.2
L1_5V_Backup: LOW1.1 R142.2 R147.2
L1_5V_Backup_a: C7.2 C51.2 IC2.24(OUT0) R33.2 R142.1 U4.1(+Vin) U4.6(Ctrl)
L1_5V_Backup_EN: CN3.2 R30.2 R35.2
L1_24V_Backup: C18.2 CN1.1 IC4.20(OUT1) LOW1.15 R67.2
L1_24V_Backup_EN: CN3.39 R60.2 R66.2
L1_current_IN3: C13.2 CN3.5 R47.2
L1_select0: CN3.6 R31.2
L1_select1: CN3.9 R32.2
L2_5V_Backup: LOW1.12 R164.2 R167.2
L2_5V_Backup_EN: CN3.33 R91.2 R95.2
L2_5V_Backupa_a: C26.2 C62.2 IC6.24(OUT0) R94.2 R164.1 U7.1(+Vin) U7.6(Ctrl)
L2_current_IN4: C22.2 CN3.38 R75.2
L2_select0: CN3.37 R62.2
L2_select1: CN3.34 R63.2
L3_5V_Backup: LOW1.11 R118.2 R122.2
L3_5V_Backup_a: C17.2 C40.2 IC4.24(OUT0) R64.2 R118.1 U3.1(+Vin) U3.6(Ctrl)
L3_5V_Backup_EN: CN3.10 R61.2 R65.2
L3_current_IN5: C31.2 CN3.31 R101.2
L3_select0: CN3.30 R92.2
L3_select1: CN3.27 R93.2
L4_5V_Backup: LOW2.14 LOW2.15 LOW2.16 LOW2.17 LOW2.18 R116.2 R121.2
L4_5V_Backup_a: C36.2 C39.2 IC8.24(OUT0) R116.1 R129.2 U2.1(+Vin) U2.6(Ctrl)
L4_5V_Backup_EN: CN3.26 R126.2 R131.2
L4_current_IN6: C46.2 CN3.24 R137.2
L4_select0: CN3.23 R127.2
L4_select1: CN3.20 R128.2
L5_current_IN7: C64.2 CN3.14 R174.2
L5_select0: CN3.15 R161.2
L5_select1: CN3.18 R163.2
LED_PC12: CN3.40 LED3.1
LOGGER_PWR: C45.2 IC8.13(OUT3) LOW1.19 R140.2
LOGGER_PWR_EN: CN3.11 R123.2 R135.2
MCU_UBR: C63.2 IC11.13(OUT3) LOW1.10 R177.2
MCU_UBR_EN: CN3.17 R157.2 R172.2
NRST: CN4.8 R130.1
PUMP_CTRL: LOW2.11
PUMP_PWR: C11.2 HIGH1.13 IC3.8(OUT1_1) IC3.9(OUT1_2) IC3.10(OUT1_3) R49.2
PUMP_PWR_EN: CN4.25 R36.2 R44.2
SWCLK: CN4.12 U5.10
SWDIO: CN4.13 U5.8
TAILLIGHT_PWR: C8.2 IC2.20(OUT1) LOW1.14 R40.2
TAILLIGHT_PWR_EN: CN3.3 R29.2 R39.2
Temperature_PWR: C27.2 IC6.20(OUT1) LOW2.5 LOW2.6 LOW2.7 LOW2.8 LOW2.9 R97.2
Temperature_PWR_EN: CN3.32 R90.2 R96.2
TSALR_PWR: C41.2 IC8.20(OUT1) LOW1.8 R133.2
TSALR_PWR_EN: CN3.25 R125.2 R132.2
USART1_RX: CN4.11 U5.7
USART1_TX: CN4.10 U5.9
USART2_RX: CN4.16 IC13.5(M_T)
USART2_TX: CN4.17 IC13.6(M_R)
VCU_Bootloader: LOW2.13 R117.1
VCU_PWR: C29.2 IC6.17(OUT2) LOW1.7 R100.2
VCU_PWR_EN: CN3.29 R89.2 R98.2
VCU_UBR: C2.2 HIGH1.3 IC1.12(OUT0_1) IC1.13(OUT0_2) IC1.14(OUT0_3) R15.2
VCU_UBR_CTRL: LOW2.12
VCU_UBR_EN: CN4.24 R9.2 R14.2
NetC37_2: C37.2 R121.1 U2.3(+Vo)
NetC38_2: C38.2 R122.1 U3.3(+Vo)
NetC44_1: C44.1 IC9.1(BOOT)
NetC44_2: C44.2 D9.1(K) IC9.8(PH) L1.1
NetC50_2: C50.2 R147.1 U4.3(+Vo)
NetC55_1: C55.1 IC12.1(BOOT)
NetC55_2: C55.2 D12.1(K) IC12.8(PH) L2.1
NetC60_2: C60.2 R167.1 U7.3(+Vo)
NetFU1_2: FU1.2 FU2.1 J2.2
NetFU3_1: FU3.1 K1.3(COM_1) K1.4(COM_2)
NetIC1_1: IC1.1(GND) R24.1
NetIC1_2: IC1.2(IN0) R14.1
NetIC1_3: IC1.3(DEN) R6.1
NetIC1_4: IC1.4(IS) R21.1 R23.2
NetIC1_5: IC1.5(DSEL) R11.1
NetIC1_6: IC1.6(IN1) R17.1
NetIC2_2: IC2.2(IN0) R35.1
NetIC2_4: IC2.4(GND) R53.2
NetIC2_5: IC2.5(IN1) R39.1
NetIC2_6: IC2.6(DEN) R26.1
NetIC2_7: IC2.7(IS) R47.1 R51.2
NetIC2_8: IC2.8(DSEL0) R31.1
NetIC2_9: IC2.9(IN2) R42.1
NetIC2_10: IC2.10(IN3) R45.1
NetIC2_11: IC2.11(DSEL1) R32.1
NetIC3_1: IC3.1(GND) R55.1
NetIC3_2: IC3.2(IN0) R41.1
NetIC3_3: IC3.3(DEN) R34.1
NetIC3_4: IC3.4(IS) R48.1 R54.2
NetIC3_5: IC3.5(DSEL) R38.1
NetIC3_6: IC3.6(IN1) R44.1
NetIC4_2: IC4.2(IN0) R65.1
NetIC4_4: IC4.4(GND) R81.2
NetIC4_5: IC4.5(IN1) R66.1
NetIC4_6: IC4.6(DEN) R57.1
NetIC4_7: IC4.7(IS) R75.1 R79.2
NetIC4_8: IC4.8(DSEL0) R62.1
NetIC4_9: IC4.9(IN2) R68.1
NetIC4_10: IC4.10(IN3) R72.1
NetIC4_11: IC4.11(DSEL1) R63.1
NetIC5_1: IC5.1(GND) R85.1
NetIC5_2: IC5.2(IN0) R76.1
NetIC5_3: IC5.3(DEN) R69.1
NetIC5_4: IC5.4(IS) R82.1 R84.2
NetIC5_5: IC5.5(DSEL) R73.1
NetIC5_6: IC5.6(IN1) R78.1
NetIC6_2: IC6.2(IN0) R95.1
NetIC6_4: IC6.4(GND) R108.2
NetIC6_5: IC6.5(IN1) R96.1
NetIC6_6: IC6.6(DEN) R87.1
NetIC6_7: IC6.7(IS) R101.1 R103.2
NetIC6_8: IC6.8(DSEL0) R92.1
NetIC6_9: IC6.9(IN2) R98.1
NetIC6_10: IC6.10(IN3) R99.1
NetIC6_11: IC6.11(DSEL1) R93.1
NetIC7_1: IC7.1(GND) R119.1
NetIC7_2: IC7.2(IN0) R109.1
NetIC7_3: IC7.3(DEN) R102.1
NetIC7_4: IC7.4(IS) R112.1 R115.2
NetIC7_5: IC7.5(DSEL) R107.1
NetIC7_6: IC7.6(IN1) R111.1
NetIC8_2: IC8.2(IN0) R131.1
NetIC8_4: IC8.4(GND) R141.2
NetIC8_5: IC8.5(IN1) R132.1
NetIC8_6: IC8.6(DEN) R120.1
NetIC8_7: IC8.7(IS) R137.1 R139.2
NetIC8_8: IC8.8(DSEL0) R127.1
NetIC8_9: IC8.9(IN2) R134.1
NetIC8_10: IC8.10(IN3) R135.1
NetIC8_11: IC8.11(DSEL1) R128.1
NetIC9_4: IC9.4(VSENSE) R144.1 R152.2
NetIC10_1: IC10.1(GND) R162.1
NetIC10_2: IC10.2(IN0) R149.1
NetIC10_3: IC10.3(DEN) R143.1
NetIC10_4: IC10.4(IS) R153.1 R155.2
NetIC10_5: IC10.5(DSEL) R148.1
NetIC10_6: IC10.6(IN1) R151.1
NetIC11_2: IC11.2(IN0) R166.1
NetIC11_4: IC11.4(GND) R178.2
NetIC11_5: IC11.5(IN1) R168.1
NetIC11_6: IC11.6(DEN) R156.1
NetIC11_7: IC11.7(IS) R174.1 R176.2
NetIC11_8: IC11.8(DSEL0) R161.1
NetIC11_9: IC11.9(IN2) R171.1
NetIC11_10: IC11.10(IN3) R172.1
NetIC11_11: IC11.11(DSEL1) R163.1
NetIC12_4: IC12.4(VSENSE) R169.1 R175.2
NetLED1_2: LED1.2 OP1.3 R16.2
NetLED3_2: LED3.2 R138.1
NetOP1_1: OP1.1 R7.1
NetOP1_4: OP1.4 R2.2
NetOP2_1: OP2.1 R10.1
NetOP2_4: OP2.4 R5.2
NetR3_1: R3.1 R12.1
NetR4_1: R4.1 R13.1
NetR50_2: R50.2 RST1.1(COMMON)
NetR117_2: R117.2 RST2.1(COMMON)
NetR130_2: R130.2 RST3.1(COMMON)

Not connected (* = marked no-connect by the designer): CN3 21; CN4 18; D1 1(A) 2(N.C.) 3(K); D2 1(A) 2(N.C.) 3(K); D3 1(A) 2(N.C.) 3(K); D5 1(A) 2(N.C.) 3(K); D6 1(A) 2(N.C.) 3(K); D7 1(A) 2(N.C.) 3(K); D8 1(A) 2(N.C.) 3(K); D10 1(A) 2(N.C.) 3(K); D13 1(A) 2(N.C.) 3(K); D14 1(A) 2(N.C.) 3(K); HIGH1 2 10 11 12; IC9 2(NC_1) 3(NC_2) 5(ENA); IC12 2(NC_1) 3(NC_2) 5(ENA); IC13 1(RI) 2(DTR) 3(U1R) 4(U1T) 7(D_T) 8(D_R) 10(CHR) 11(SDA) 12(SCL) 13(3V8) 14(EN) 17(BAT) 19(R/PK) 20(IO19); J2 3* 4*; LOW1 2 3 13 21 22; LOW2 4 19 20; R24 2; R53 1; R55 2; R81 1; R85 2; R108 1; R119 2; R141 1; R162 2; R178 1; U2 4(Trim); U3 4(Trim); U4 4(Trim); U7 4(Trim)

## Notes on the sheet
- 架构图
- 最大量程16.5V¦防止通道过压
- 指示正常上VBAT和核心板电源正常供电
- 加一个多刀开关？
- GPIO读取是否上低压¦上低压是高电平
- 电池指示灯(白)
- GLVMS上电指示灯（绿）
- 这里原来串联了一个0Ω电阻
- L1_24V_Backup征用为PDB风扇供电(带PWM功能)
- (near LOW2) 温度传感器¦一个24V输出口（余4端口）
- 24V
- 5V可兼容24V供电
- 反接二极管¦要求配套保险丝30A以下,最好折半
- 瞬态抑制二极管¦钳位45.4V
- 改为TAILLIGHT_PWR
- 改为L1_24V_Backup
- 还备留IO口？
- 5V
- ACCU_PWR和ACCU_UBR分别供？
- (near K1) 改为MCU_UBR
- (near K1) 改为PUMP供电
- 改为FAN3_PWR
- 空着
- 改为FAN1_PWR
- (near K2) 仪表激活按钮按下且上了高压（AIR）才能成功激活，闭合激活继电器，安全回路上电
- 24V大电流¦备份了3个24V 24V单口最大输出3A
- 已用满，后期换2*25的连接器
- (near CN4) 板对板连接器_母
- ？？？
- (near R116) 切换24V输出
- (near R118) 切换24V输出
- VCU Bootload 按键
- PDB复位按键
- PDB工作指示灯（蓝）
- (near R142) 切换24V输出
- (near C48) C2012X5R1V226MT000E
- (near *1) 下载调试接口
- 能量计、BDU供电有？
- 24V转5V电源¦最大输出5A
- (near R164) 切换24V输出
- 参考手册的10TPB330M钽电容\功率电感，另外参考电阻改为20K/3.6K
- CAN调试接口
- (near C58) C2012X5R1V226MT000E
- 75mil左右，最小60
- 执行层
- 4G模块自带反接保护，电压跌落保护
- 4G模块拓展座
- 24V转5V电源组¦最大输出电流1A
- 功率电感换为YSPI1040TP-220M，22uF，额定电流6A，饱和电流9A(借用了SDRH104R-3R3NT的封装)
- 转动舵机会导致电流回流（应该问题不大）
- 小电流¦单口最大输出1A
- PCB表面24mil可以
- 24V转8V¦可持续5A的输出电流(实在不行换TPS5430)
- 如果出现多个故障可闪烁切换表示
- Labels drawn without touching a wire or pin: GND
- ENG:
- DSN:
- APPROVALS
- DATE
- PROJECT REVISION:
- Vehicle Number:
- E33
- DOCUMENT REVISION:
- Wuhan University of Techonology
- Formula Student Electric Racing Team
- No. 122, Luoshi Road, Wuhan
- Hubei Provence, China
- Design Item:
- CHK:
- BOM:
- REFERENCE DOCUMENTS
- TITLE
- FAB DWG:
- PCB DWG:
- ASSY DWG:
- SCALE:
- A1
- SIZE
- FILE NAME
- WUTE racing team
- SHEET
- OF
- REV

## Library data of the parts
C1-C36 C41-C46 C48 C49 C52-C56 C58 C59 C61 C63 C64 = SMD_MLCC: Std MLCC Cap; voltage rating: ?V
  C1 C5 C6 C15 C16 C25 C28 C35 C43 C52: Type: 100nF
  C2 C3 C7-C12 C17-C21 C23 C26 C27 C29 C30 C32 C33 C36 C41 C42 C44 C45 C49 C53 C55 C56 C59 C61 C63: Type: 10nF
  C4 C13 C14 C22 C24 C31 C34 C46 C54 C64: Type: 100pF
  C48 C58: Type: 22uF
C37-C40 C50 C51 C60 C62 = SMD_MLCC: Std MLCC Cap
  C37 C38 C50 C60: Type: 22uF\10V
  C39 C40 C51 C62: Type: 10uF 50V
C47 C57 = 10TPB330M: Capacitor Polarised; Manufacturer_Name: Panasonic; Datasheet Link: http://industrial.panasonic.com/cdbs/www-data/pdf/AAA8000/AAA8000C65.pdf; Manufacturer_Part_Number: 10TPB330M; Mouser Part Number: 667-10TPB330M; Mouser Price/Stock: https://www.mouser.co.uk/ProductDetail/Panasonic/10TPB330M?qs=OE1iw1LrrPGJ%2FhG9UwG4gg%3D%3D; Arrow Part Number: 10TPB330M; Arrow Price/Stock: https://www.arrow.com/en/products/10tpb330m/panasonic?region=nac
CN1 = XH-2A_C20079: Manufacturer: BOOMELE(博穆精密); Add into BOM: yes; Pins Structure: 1x2P; Pitch: 2.5mm; Reference Series: XH; Number of PINs Per Row: 2; Name: XH-2A; Symbol: XH-2A; Device: XH-2A_C20079; LCSC Part Name: 系列:XH 间距:2.5mm 1x2P; Supplier Part: C20079; Manufacturer Part: XH-2A; Supplier Footprint: 插件,P=2.5mm; JLCPCB Part Class: Extended Part; Datasheet: https://atta.szlcsc.com/upload/public/pdf/source/20151225/1457707654857.pdf; Supplier: LCSC; Convert to PCB: yes; Mounting Style: -; Number of Pins: 2P; Number of Rows: 1; Row Spacing: -; Contact Material: -
CN4 = BTB_0.8mm_40Pin_Mother: System: Connector
D1-D3 D5-D8 D10 D13 D14 = BAS21,215: Diode; Manufacturer_Name: Nexperia; Datasheet Link: https://assets.nexperia.com/documents/data-sheet/BAS21.pdf; Height: 1.1mm; Manufacturer_Part_Number: BAS21,215; Mouser Part Number: 771-BAS21-T/R; Mouser Price/Stock: https://www.mouser.co.uk/ProductDetail/Nexperia/BAS21215?qs=me8TqzrmIYVAUvbefFMRnQ%3D%3D; Arrow Part Number: BAS21,215; Arrow Price/Stock: https://www.arrow.com/en/products/bas21215/nexperia
D4 = SMAJ28CA_C353457: C353457; Manufacturer: 晶导微电子; Add into BOM: yes; Reverse Stand-Off Voltage (Vrwm): 28V; Maximum Clamping Voltage: 45.4V; Peak Pulse Current (Ipp)@10/1000us: 8.8A; Breakdown Voltage: 31.1V; Reverse Leakage Current (Ir): 1uA; Type: TVS; Symbol: SMAJ28CA_C353457; Device: SMAJ28CA_C353457; LCSC Part Name: 双向TVS 28V截止 8.8A峰值脉冲; Supplier Part: C353457; Manufacturer Part: SMAJ28CA; Supplier Footprint: SMA; JLCPCB Part Class: Extended Part; Datasheet: https://atta.szlcsc.com/upload/public/pdf/source/20190103/C353498_9C52E1B7CA7D9691073072057BB1DA1A.pdf; Supplier: LCSC; Convert to PCB: yes
D9 D12 = B540C-13-F: Diode; Manufacturer_Name: Diodes Incorporated; Datasheet Link: https://componentsearchengine.com/Datasheets/2/B540C-13-F.pdf; Height: 2.5mm; Manufacturer_Part_Number: B540C-13-F; Mouser Part Number: 621-B540C-F; Mouser Price/Stock: https://www.mouser.co.uk/ProductDetail/Diodes-Incorporated/B540C-13-F?qs=v2dnQLbuoRZXHN%2FK4ft5%252Bg%3D%3D; Arrow Part Number: B540C-13-F; Arrow Price/Stock: https://www.arrow.com/en/products/b540c-13-f/diodes-incorporated?region=nac
FU1-FU3 = XF-506P: 小型汽车插片保险丝座
IC1 IC3 IC5 IC7 IC10 = BTT60502ERAXUMA1: Integrated Circuit; Manufacturer_Name: Infineon; Datasheet Link: https://www.infineon.com/dgdl/Infineon-BTT6050-2ERA-DS-v01_00-EN.pdf?fileId=5546d46269e1c019016a21d599df0d6a; Height: 1.15mm; Manufacturer_Part_Number: BTT60502ERAXUMA1; Mouser Part Number: 726-BTT60502ERAXUMA1; Mouser Price/Stock: https://www.mouser.co.uk/ProductDetail/Infineon-Technologies/BTT60502ERAXUMA1?qs=mAH9sUMRCtsi1%2FDCmYjCiw%3D%3D; Arrow Part Number: BTT60502ERAXUMA1; Arrow Price/Stock: https://www.arrow.com/en/products/btt60502eraxuma1/infineon-technologies-ag?region=nac
IC2 IC4 IC6 IC8 IC11 = BTT62004ESAXUMA1: Integrated Circuit; Manufacturer_Name: Infineon; Datasheet Link: https://componentsearchengine.com/Datasheets/2/BTT62004ESAXUMA1.pdf; Height: 1.15mm; Manufacturer_Part_Number: BTT62004ESAXUMA1; Mouser Part Number: 726-BTT62004ESAXUMA1; Mouser Price/Stock: https://www.mouser.co.uk/ProductDetail/Infineon-Technologies/BTT62004ESAXUMA1?qs=unwgFEO1A6tpV1sLwJtTRA%3D%3D; Arrow Part Number: BTT62004ESAXUMA1; Arrow Price/Stock: https://www.arrow.com/en/products/btt62004esaxuma1/infineon-technologies-ag
IC9 IC12 = TPS5450DDA: Integrated Circuit; Manufacturer_Name: Texas Instruments; Datasheet Link: http://www.ti.com/lit/ds/symlink/tps5450.pdf; Height: 1.7mm; Manufacturer_Part_Number: TPS5450DDA; Mouser Part Number: 595-TPS5450DDA; Mouser Price/Stock: https://www.mouser.co.uk/ProductDetail/Texas-Instruments/TPS5450DDA?qs=h%2FYsCRHtaqPow3uMxnjN5A%3D%3D; Arrow Part Number: TPS5450DDA; Arrow Price/Stock: https://www.arrow.com/en/products/tps5450dda/texas-instruments?region=nac
J1 J3 = AmassXTxx_Connector: Type: XT60H
J2 = XT60PW-M: Connector; Manufacturer_Name: Changzou Amass Elec; Datasheet Link: https://www.tme.eu/Document/9b8d0c5eb7094295f3d3112c214d3ade/XT60PW%20SPEC.pdf; Height: 8.4mm; Manufacturer_Part_Number: XT60PW-M
K1 = HF14FW/024-HSTF: Relay or Contactor; Manufacturer_Name: Hongfa; Datasheet Link: https://docs.rs-online.com/d608/0900766b81663c99.pdf; Height: 26.5mm; Manufacturer_Part_Number: HF14FW/024-HSTF
K2 = HF46F_024-HS1T: Relay or Contactor; Manufacturer_Name: Hongfa; Manufacturer_Part_Number: HF46F/024-HS1T; Datasheet Link: https://www.tme.com/Document/c87786c546bba5bb9984c9460ff2ec46/HF46F_en.pdf; Height: 15.6mm
L1 L2 = SDRH104R-3R3NT: Inductor; Manufacturer_Name: TSA; Datasheet Link: http://www.tsasun.com/uploadfile/SDRH%20Series.pdf; Height: 4.1mm; Manufacturer_Part_Number: SDRH104R-3R3NT
LED1-LED3 = LED: Light Emitting Diode; Type: 0805-R; Type2: DIP-HDR1*2-R
LOW1 = 43045-2012: Connector; Manufacturer_Name: Molex; Datasheet Link: https://www.molex.com/pdm_docs/sd/430450612_sd.pdf; Height: 9.91mm; Manufacturer_Part_Number: 43045-2012; Mouser Part Number: 538-43045-2012; Mouser Price/Stock: https://www.mouser.co.uk/ProductDetail/Molex/43045-2012?qs=UeCeOHRHQeaNtH3DnNjSvA%3D%3D
LOW2 = 43045-1812: Connector; Manufacturer_Name: Molex; Datasheet Link: https://www.molex.com/pdm_docs/sd/430450612_sd.pdf; Height: 9.91mm; Manufacturer_Part_Number: 43045-1812; Mouser Part Number: 538-43045-1812; Mouser Price/Stock: https://www.mouser.co.uk/ProductDetail/Molex/43045-1812?qs=mrPiglD9aYKqQsv7cU%2F4pg%3D%3D
OP1 OP2 = EL357N(C)(TA)-VG: No Description Available / 立创编号：C108648; Mfr_Name: Everlight; RefDes: RefDes; Type: Type
R2 R5 R7 R10 R12 R13 R16 R18 = SMD_Resistor: Std Resistor
  R2 R5 R7 R10: Type: 3K
  R12: Type: 20K
  R13: Type: 15K
  R16 R18: Type: 10K
R3 R4 R6 R8 R9 R11 R14 R15 R17 R19-R55 R57-R178 = SMD_Resistor: Std Resistor; power rating: 100mW; voltage rating: 75V
  R3: Type: 20K
  R4: Type: 75K
  R6 R8 R9 R11 R14 R17 R19-R21 R26-R32 R34-R39 R41 R42 R44 R45 R47 R48 R57-R63 R65 R66 R68-R73 R75 R76 R78 R82 R87-R93 R95 R96 R98 R99 R101 R102 R104 R105 R107 R109 R111 R112 R117 R120 R123-R128 R131 R132 R134 R135 R137 R143-R146 R148 R149 R151 R153 R156-R161 R163 R166 R168 R169 R171 R172 R174: Type: 10K
  R15 R22 R33 R40 R43 R46 R49 R52 R64 R67 R74 R77 R80 R83 R94 R97 R100 R106 R110 R113 R129 R133 R136 R140 R150 R154 R165 R170 R173 R177: Type: 47K
  R23 R51 R54 R79 R84 R103 R115 R139 R155 R176: Type: 650Ω
  R24 R53 R55 R81 R85 R108 R119 R141 R162 R178: Type: 27
  R25 R86 R114: Type: 0Ω
  R50 R130: Type: 1K
  R116 R118 R121 R122 R142 R147 R164 R167: Type: 0
  R138: Type: 3K
  R152 R175: Type: 1.8K
RST1-RST3 = TS-1088-AR02016: Switch; Manufacturer_Name: XUNPU; Datasheet Link: https://www.xunpudianzi.com/uploads/pdf/TS-1088-ARXXX.pdf; Height: 2mm; Manufacturer_Part_Number: TS-1088-AR02016
U1 = M7_C2902910: Manufacturer: MSKSEMI(美森科); Manufacturer Part: M7; Add into BOM: yes; Forward Voltage (Vf@If): 1.1V@1A; Reverse Voltage (Vr): 1kV; Average Rectified Current (Io): 1A; Reverse Leakage Current: 5uA@1kV; Symbol: M7_C2902910; Device: M7_C2902910; LCSC Part Name: 电压:1kV 电流:1A; Supplier Part: C2902910; Supplier Footprint: DO-214AC; JLCPCB Part Class: Extended Part; Datasheet: https://atta.szlcsc.com/upload/public/pdf/source/20230818/6D837163743024F173AA17A66C45A9BC.pdf; Supplier: LCSC; Convert to PCB: yes; Diode Configuration: -
U2-U4 U7 = K78052MT_1000R4
U5 = ZX-PZ2.54-2-5PZZ: Manufacturer: Megastar(兆星); Add into BOM: yes; Pin Structure: 2x5P; Pitch: 2.54mm; Circluar Pins/Square Pins: 方针; Current Rating (Max): 3A; Voltage Rating (Max): 1kV; Soldering Temperature(Max): 260℃@5s; Symbol: ZX-PZ2.54-2-5PZZ; Device: ZX-PZ2.54-2-5PZZ; Supplier: LCSC; Supplier Part: C7501276; Manufacturer Part: ZX-PZ2.54-2-5PZZ; JLCPCB Part Class: Extended Part; LCSC Part Name: 间距:2.54mm 2x5P 直插 方针; Supplier Footprint: 插件,P=2.54mm; Datasheet: https://atta.szlcsc.com/upload/public/pdf/source/20231122/7DD2FA5A7FDBC10CDDB6051CB6BC6AD1.pdf; Convert to PCB: yes; Row Spacing: 2.54mm; Mounting Type: 直插; Number of Rows: 双排; Number of Pins: 5P; Length of Mating Pin: 6mm; Insulation Height: 2.5mm; Length of End Connection Pin: 3mm; Contact Material: 黄铜; Contact Plating: 金; Operating Temperature Range: -40℃~+105℃; Color: 黑色
U6 = KF301-5.0-2P: 螺钉式接线端子 C474881; Manufacturer: KEFA(科发); Add into BOM: yes; Structure: 1x2P; Pitch: 5mm; Current Rating (Max): 17A; Voltage Rating (Max): 250V; Wire Gauge - AWG: 14~22; Wire Gauge - mm2: 1.5; Number of PINs Per Row: 2; Symbol: KF301-5.0-2P; Device: KF301-5.0-2P; Supplier: LCSC; Supplier Part: C474881; Manufacturer Part: KF301-5.0-2P; JLCPCB Part Class: Extended Part; LCSC Part Name: 5mm 1x2P 排数:1 每排P数:2 直插; Supplier Footprint: 插件,P=5mm; Datasheet: https://atta.szlcsc.com/upload/public/pdf/source/20230317/03A5B5FC229D6F9225E8F51DA1A4E80A.pdf; Convert to PCB: yes; Color: 蓝色; Mounting Style: 直插; Number of Pins: 2P; Number of Rows: 1; Operating Temperature Range: -30℃~+120℃
ZDB1-ZDB10 = TVS_Diode_Bipolar: Bipolar Transient Voltage Supressor; value: 58V; Type: SMAJ58CA